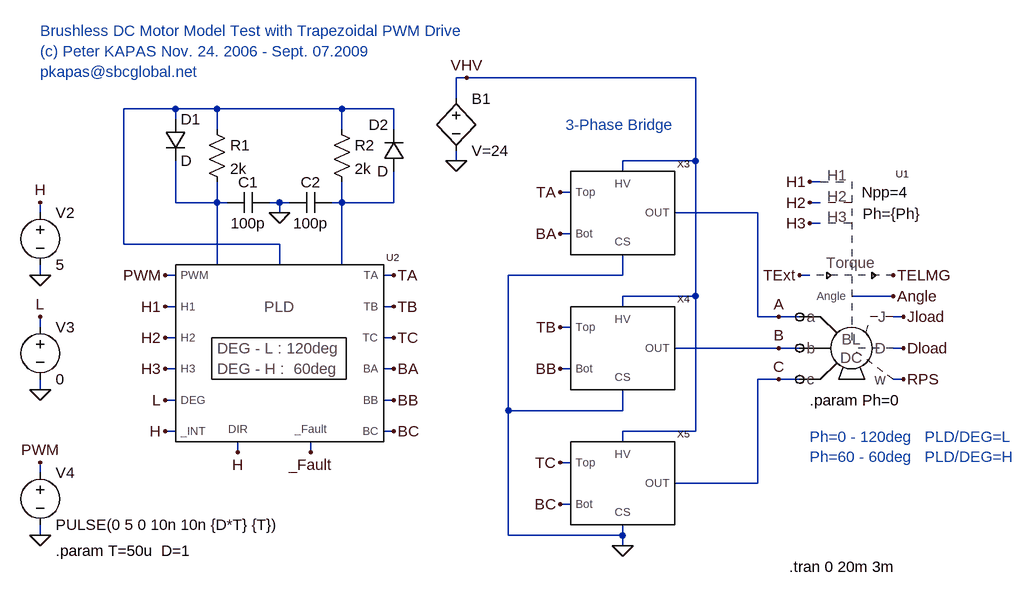
[diagram p0: schematic MotorTest01.asc]
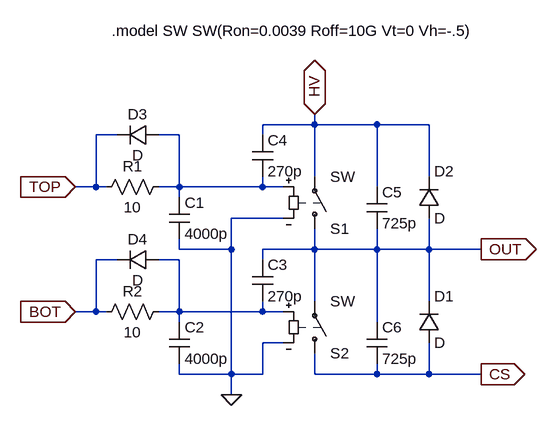
[diagram p1: sub-circuit driverx.asc]
MotorTest01.asc, the LTspice schematic file:
Version 4
SHEET 1 880 804
WIRE -464 -176 -480 -176
WIRE -112 -176 -464 -176
WIRE -480 -144 -480 -176
WIRE -912 -128 -992 -128
WIRE -848 -128 -912 -128
WIRE -656 -128 -848 -128
WIRE -576 -128 -656 -128
WIRE -912 -112 -912 -128
WIRE -848 -96 -848 -128
WIRE -656 -96 -656 -128
WIRE -576 -96 -576 -128
WIRE -480 -48 -480 -64
WIRE -112 -48 -112 -176
WIRE -112 -48 -224 -48
WIRE -224 -32 -224 -48
WIRE 80 -16 64 -16
WIRE -304 0 -320 0
WIRE -912 16 -912 -48
WIRE -848 16 -848 -16
WIRE -848 16 -912 16
WIRE -832 16 -848 16
WIRE -752 16 -768 16
WIRE -736 16 -752 16
WIRE -656 16 -656 -16
WIRE -656 16 -672 16
WIRE -576 16 -576 -32
WIRE -576 16 -656 16
WIRE 80 16 64 16
WIRE -1120 32 -1120 16
WIRE -752 32 -752 16
WIRE -16 32 -144 32
WIRE 80 48 64 48
WIRE -304 64 -320 64
WIRE -992 80 -992 -128
WIRE -752 80 -992 80
WIRE -848 112 -848 16
WIRE -752 112 -752 80
WIRE -656 112 -656 16
WIRE -1120 128 -1120 112
WIRE -912 128 -928 128
WIRE -576 128 -592 128
WIRE -224 128 -224 96
WIRE -224 128 -400 128
WIRE 64 128 48 128
WIRE -112 160 -112 -48
WIRE -112 160 -224 160
WIRE 192 160 128 160
WIRE -912 176 -928 176
WIRE -576 176 -592 176
WIRE -224 176 -224 160
WIRE -16 192 -16 32
WIRE 16 192 -16 192
WIRE 48 192 16 192
WIRE 208 192 192 192
WIRE -1120 208 -1120 192
WIRE -304 208 -320 208
WIRE -912 224 -928 224
WIRE -576 224 -592 224
WIRE 16 240 -144 240
WIRE 48 240 16 240
WIRE 208 240 192 240
WIRE -912 272 -928 272
WIRE -576 272 -592 272
WIRE -304 272 -320 272
WIRE 16 288 -16 288
WIRE 48 288 16 288
WIRE 208 288 192 288
WIRE -1120 304 -1120 288
WIRE -912 320 -928 320
WIRE -576 320 -592 320
WIRE -400 336 -400 128
WIRE -224 336 -224 304
WIRE -224 336 -400 336
WIRE -912 368 -928 368
WIRE -576 368 -592 368
WIRE -112 368 -112 160
WIRE -112 368 -224 368
WIRE -224 384 -224 368
WIRE -816 400 -816 384
WIRE -704 400 -704 384
WIRE -304 416 -320 416
WIRE -1120 432 -1120 416
WIRE -16 448 -16 288
WIRE -16 448 -144 448
WIRE -304 480 -320 480
WIRE -1120 528 -1120 512
WIRE -400 528 -400 336
WIRE -224 528 -224 512
WIRE -224 528 -400 528
WIRE -224 544 -224 528
FLAG 192 160 Angle
FLAG 208 288 RPS
FLAG 16 192 A
FLAG 16 240 B
FLAG 16 288 C
FLAG -576 128 TA
FLAG -576 176 TB
FLAG -576 320 BB
FLAG -576 224 TC
FLAG -576 368 BC
FLAG -576 272 BA
FLAG -320 0 TA
FLAG -320 208 TB
FLAG -320 416 TC
FLAG -320 64 BA
FLAG -320 272 BB
FLAG -320 480 BC
FLAG -480 -48 0
FLAG -752 32 0
FLAG -1120 128 0
FLAG -1120 16 H
FLAG -1120 304 0
FLAG -1120 192 L
FLAG -928 176 H1
FLAG -928 224 H2
FLAG -928 272 H3
FLAG -928 320 L
FLAG -928 368 H
FLAG -816 400 H
FLAG -1120 528 0
FLAG -1120 416 PWM
FLAG -928 128 PWM
FLAG -224 544 0
FLAG 192 128 TELMG
FLAG -464 -176 VHV
FLAG 64 -16 H1
FLAG 64 16 H2
FLAG 64 48 H3
FLAG -704 400 _Fault
FLAG 48 128 TExt
FLAG 208 192 Jload
FLAG 208 240 Dload
SYMBOL res -864 -112 R0
SYMATTR InstName R1
SYMATTR Value 2k
SYMBOL res -672 -112 R0
SYMATTR InstName R2
SYMATTR Value 2k
SYMBOL cap -768 0 R90
WINDOW 0 0 32 VBottom 0
WINDOW 3 32 32 VTop 0
SYMATTR InstName C1
SYMATTR Value 100p
SYMBOL cap -672 0 R90
WINDOW 0 0 32 VBottom 0
WINDOW 3 32 32 VTop 0
SYMATTR InstName C2
SYMATTR Value 100p
SYMBOL diode -928 -112 R0
SYMATTR InstName D1
SYMBOL diode -560 -32 R180
WINDOW 0 24 72 Left 0
WINDOW 3 24 0 Left 0
SYMATTR InstName D2
SYMBOL voltage -1120 16 R0
SYMATTR InstName V2
SYMATTR Value 5
SYMBOL voltage -1120 192 R0
SYMATTR InstName V3
SYMATTR Value 0
SYMBOL voltage -1120 416 R0
WINDOW 123 0 0 Left 0
WINDOW 39 0 0 Left 0
SYMATTR InstName V4
SYMATTR Value PULSE(0 5 0 10n 10n {D*T} {T})
SYMBOL driverx -240 32 R0
SYMATTR InstName X3
SYMBOL driverx -240 240 R0
SYMATTR InstName X4
SYMBOL driverx -240 448 R0
SYMATTR InstName X5
SYMBOL bv -480 -160 R0
SYMATTR InstName B1
SYMATTR Value V=24
SYMBOL SWITCH3 -736 240 R0
SYMATTR InstName U2
SYMBOL BLDC 128 240 R0
SYMATTR Value2 Npp=4
SYMATTR InstName U1
TEXT 32 576 Left 0 !.tran 0 20m 3m
TEXT -1120 -248 Left 0 ;Brushless DC Motor Model Test with Trapezoidal PWM Drive\n(c) Peter KAPAS Nov. 24. 2006 - Sept. 07.2009\npkapas@sbcglobal.net
TEXT 64 376 Left 0 ;Ph=0 - 120deg   PLD/DEG=L\nPh=60 - 60deg   PLD/DEG=H
TEXT -1096 552 Left 0 !.param T=50u  D=1
TEXT 64 320 Left 0 !.param Ph=0
TEXT -312 -104 Left 0 ;3-Phase Bridge

driverx.asc, the sub-circuit schematic file:
Version 4
SHEET 1 880 680
WIRE 144 80 144 64
WIRE 144 80 64 80
WIRE 240 80 144 80
WIRE 320 80 240 80
WIRE -160 96 -192 96
WIRE -64 96 -96 96
WIRE 64 96 64 80
WIRE 144 160 144 80
WIRE 320 160 320 80
WIRE -192 176 -192 96
WIRE -192 176 -224 176
WIRE -176 176 -192 176
WIRE -64 176 -64 96
WIRE -64 176 -96 176
WIRE 64 176 64 160
WIRE 64 176 -64 176
WIRE 96 176 64 176
WIRE 240 176 240 80
WIRE -64 192 -64 176
WIRE 96 224 16 224
WIRE -64 272 -64 256
WIRE 16 272 16 224
WIRE 16 272 -64 272
WIRE 144 272 144 240
WIRE 144 272 64 272
WIRE 240 272 240 240
WIRE 240 272 144 272
WIRE 320 272 320 224
WIRE 320 272 240 272
WIRE 400 272 320 272
WIRE -160 288 -192 288
WIRE -64 288 -96 288
WIRE 64 288 64 272
WIRE 144 352 144 272
WIRE 320 352 320 272
WIRE -192 368 -192 288
WIRE -192 368 -224 368
WIRE -176 368 -192 368
WIRE -64 368 -64 288
WIRE -64 368 -96 368
WIRE 64 368 64 352
WIRE 64 368 -64 368
WIRE 96 368 64 368
WIRE -64 384 -64 368
WIRE 240 384 240 272
WIRE 96 416 64 416
WIRE -64 464 -64 448
WIRE 16 464 16 272
WIRE 16 464 -64 464
WIRE 64 464 64 416
WIRE 64 464 16 464
WIRE 144 464 144 432
WIRE 240 464 240 448
WIRE 240 464 144 464
WIRE 320 464 320 416
WIRE 320 464 240 464
WIRE 400 464 320 464
WIRE 16 496 16 464
FLAG 16 496 0
FLAG -224 176 TOP
IOPIN -224 176 In
FLAG -224 368 BOT
IOPIN -224 368 In
FLAG 400 272 OUT
IOPIN 400 272 Out
FLAG 144 64 HV
IOPIN 144 64 BiDir
FLAG 400 464 CS
IOPIN 400 464 Out
SYMBOL sw 144 256 M180
SYMATTR InstName S1
SYMBOL sw 144 448 M180
SYMATTR InstName S2
SYMBOL diode 304 416 M180
WINDOW 0 24 72 Left 0
WINDOW 3 24 0 Left 0
SYMATTR InstName D1
SYMBOL diode 304 224 M180
WINDOW 0 24 72 Left 0
WINDOW 3 24 0 Left 0
SYMATTR InstName D2
SYMBOL cap -80 192 R0
SYMATTR InstName C1
SYMATTR Value 4000p
SYMBOL cap -80 384 R0
SYMATTR InstName C2
SYMATTR Value 4000p
SYMBOL res -80 160 R90
WINDOW 0 0 56 VBottom 0
WINDOW 3 32 56 VTop 0
SYMATTR InstName R1
SYMATTR Value 10
SYMBOL res -80 352 R90
WINDOW 0 0 56 VBottom 0
WINDOW 3 32 56 VTop 0
SYMATTR InstName R2
SYMATTR Value 10
SYMBOL diode -96 80 R90
WINDOW 0 0 32 VBottom 0
WINDOW 3 32 32 VTop 0
SYMATTR InstName D3
SYMBOL diode -96 272 R90
WINDOW 0 0 32 VBottom 0
WINDOW 3 32 32 VTop 0
SYMATTR InstName D4
SYMBOL cap 48 288 R0
SYMATTR InstName C3
SYMATTR Value 270p
SYMBOL cap 48 96 R0
SYMATTR InstName C4
SYMATTR Value 270p
SYMBOL cap 224 176 R0
SYMATTR InstName C5
SYMATTR Value 725p
SYMBOL cap 224 384 R0
SYMATTR InstName C6
SYMATTR Value 725p
TEXT -168 -64 Left 0 !.model SW SW(Ron=0.0039 Roff=10G Vt=0 Vh=-.5)

The netlist it stands for:
* MotorTest01.asc
R1 N001 N002 2k
R2 N001 N003 2k
C1 0 N002 100p
C2 N003 0 100p
D1 N001 N002 D
D2 N003 N001 D
V2 H 0 5
V3 L 0 0
V4 PWM 0 PULSE(0 5 0 10n 10n {D*T} {T})
XX3 TA BA VHV A 0 driverx
XX4 TB BB VHV B 0 driverx
XX5 TC BC VHV C 0 driverx
B1 VHV 0 V=24
XU2 H1 H2 H3 L H PWM TA TB TC BA BB BC H N001 N002 N003 _Fault SWITCH3  ; pins H1 H2 H3 DEG _INT PWM TA TB TC BA BB BC DIR RC RC1 RC2 _Fault
XU1 A B C Jload Dload TExt TELMG RPS Angle H1 H2 H3 BLDC Npp=4 Ph={Ph}  ; pins A B C LoadInertia LoadDump Tin Tout W Angle H1 H2 H3

* block symbol definitions
.subckt driverx Top Bot HV OUT CS
S1 OUT HV N001 0 SW
S2 CS OUT N002 0 SW
D1 CS OUT D
D2 OUT HV D
C1 N001 0 4000p
C2 N002 0 4000p
R1 N001 TOP 10
R2 N002 BOT 10
D3 N001 TOP D
D4 N002 BOT D
C3 OUT N002 270p
C4 HV N001 270p
C5 HV OUT 725p
C6 OUT CS 725p
.model SW SW(Ron=0.0039 Roff=10G Vt=0 Vh=-.5)
.ends driverx

.model D D
.lib standard.dio
.tran 0 20m 3m
* Brushless DC Motor Model Test with Trapezoidal PWM Drive
* (c) Peter KAPAS Nov. 24. 2006 - Sept. 07.2009
* pkapas@sbcglobal.net
* Ph=0 - 120deg   PLD/DEG=L
* Ph=60 - 60deg   PLD/DEG=H
.param T=50u  D=1
.param Ph=0
* 3-Phase Bridge
.lib BLDCSupport.Lib
.lib BLDC.Lib
.backanno
.end